# Altium schematic sheet Modulo_Adaptador.SchDoc
size A4
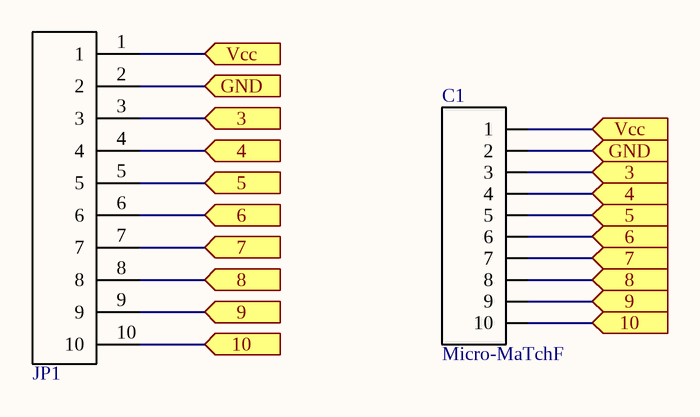
[diagram p0: Modulo_Adaptador.SchDoc]

## Parts
C1  Micro-MaTchF  [Micro-MaTch Famale 1.27mm/ Hole]
JP1  Pines (10X2.54)  [Pin(10X2.54mm)]  (value not drawn)

## Ports
3 (in), 4 (in), 5 (in), 6 (in), 7 (in), 8 (in), 9 (in), 10 (in), GND (in), Vcc (in)

## Nets
3: C1.3 JP1.3 ; port 3
4: C1.4 JP1.4 ; port 4
5: C1.5 JP1.5 ; port 5
6: C1.6 JP1.6 ; port 6
7: C1.7 JP1.7 ; port 7
8: C1.8 JP1.8 ; port 8
9: C1.9 JP1.9 ; port 9
10: C1.10 JP1.10 ; port 10
GND: C1.2 JP1.2 ; port GND
Vcc: C1.1 JP1.1 ; port Vcc

## Library data of the parts
C1 = Micro-MaTchF: Micro-MaTch Famale 1.27mm T/Hole